# Altium schematic sheet AD7606_Core.SchDoc
size A3
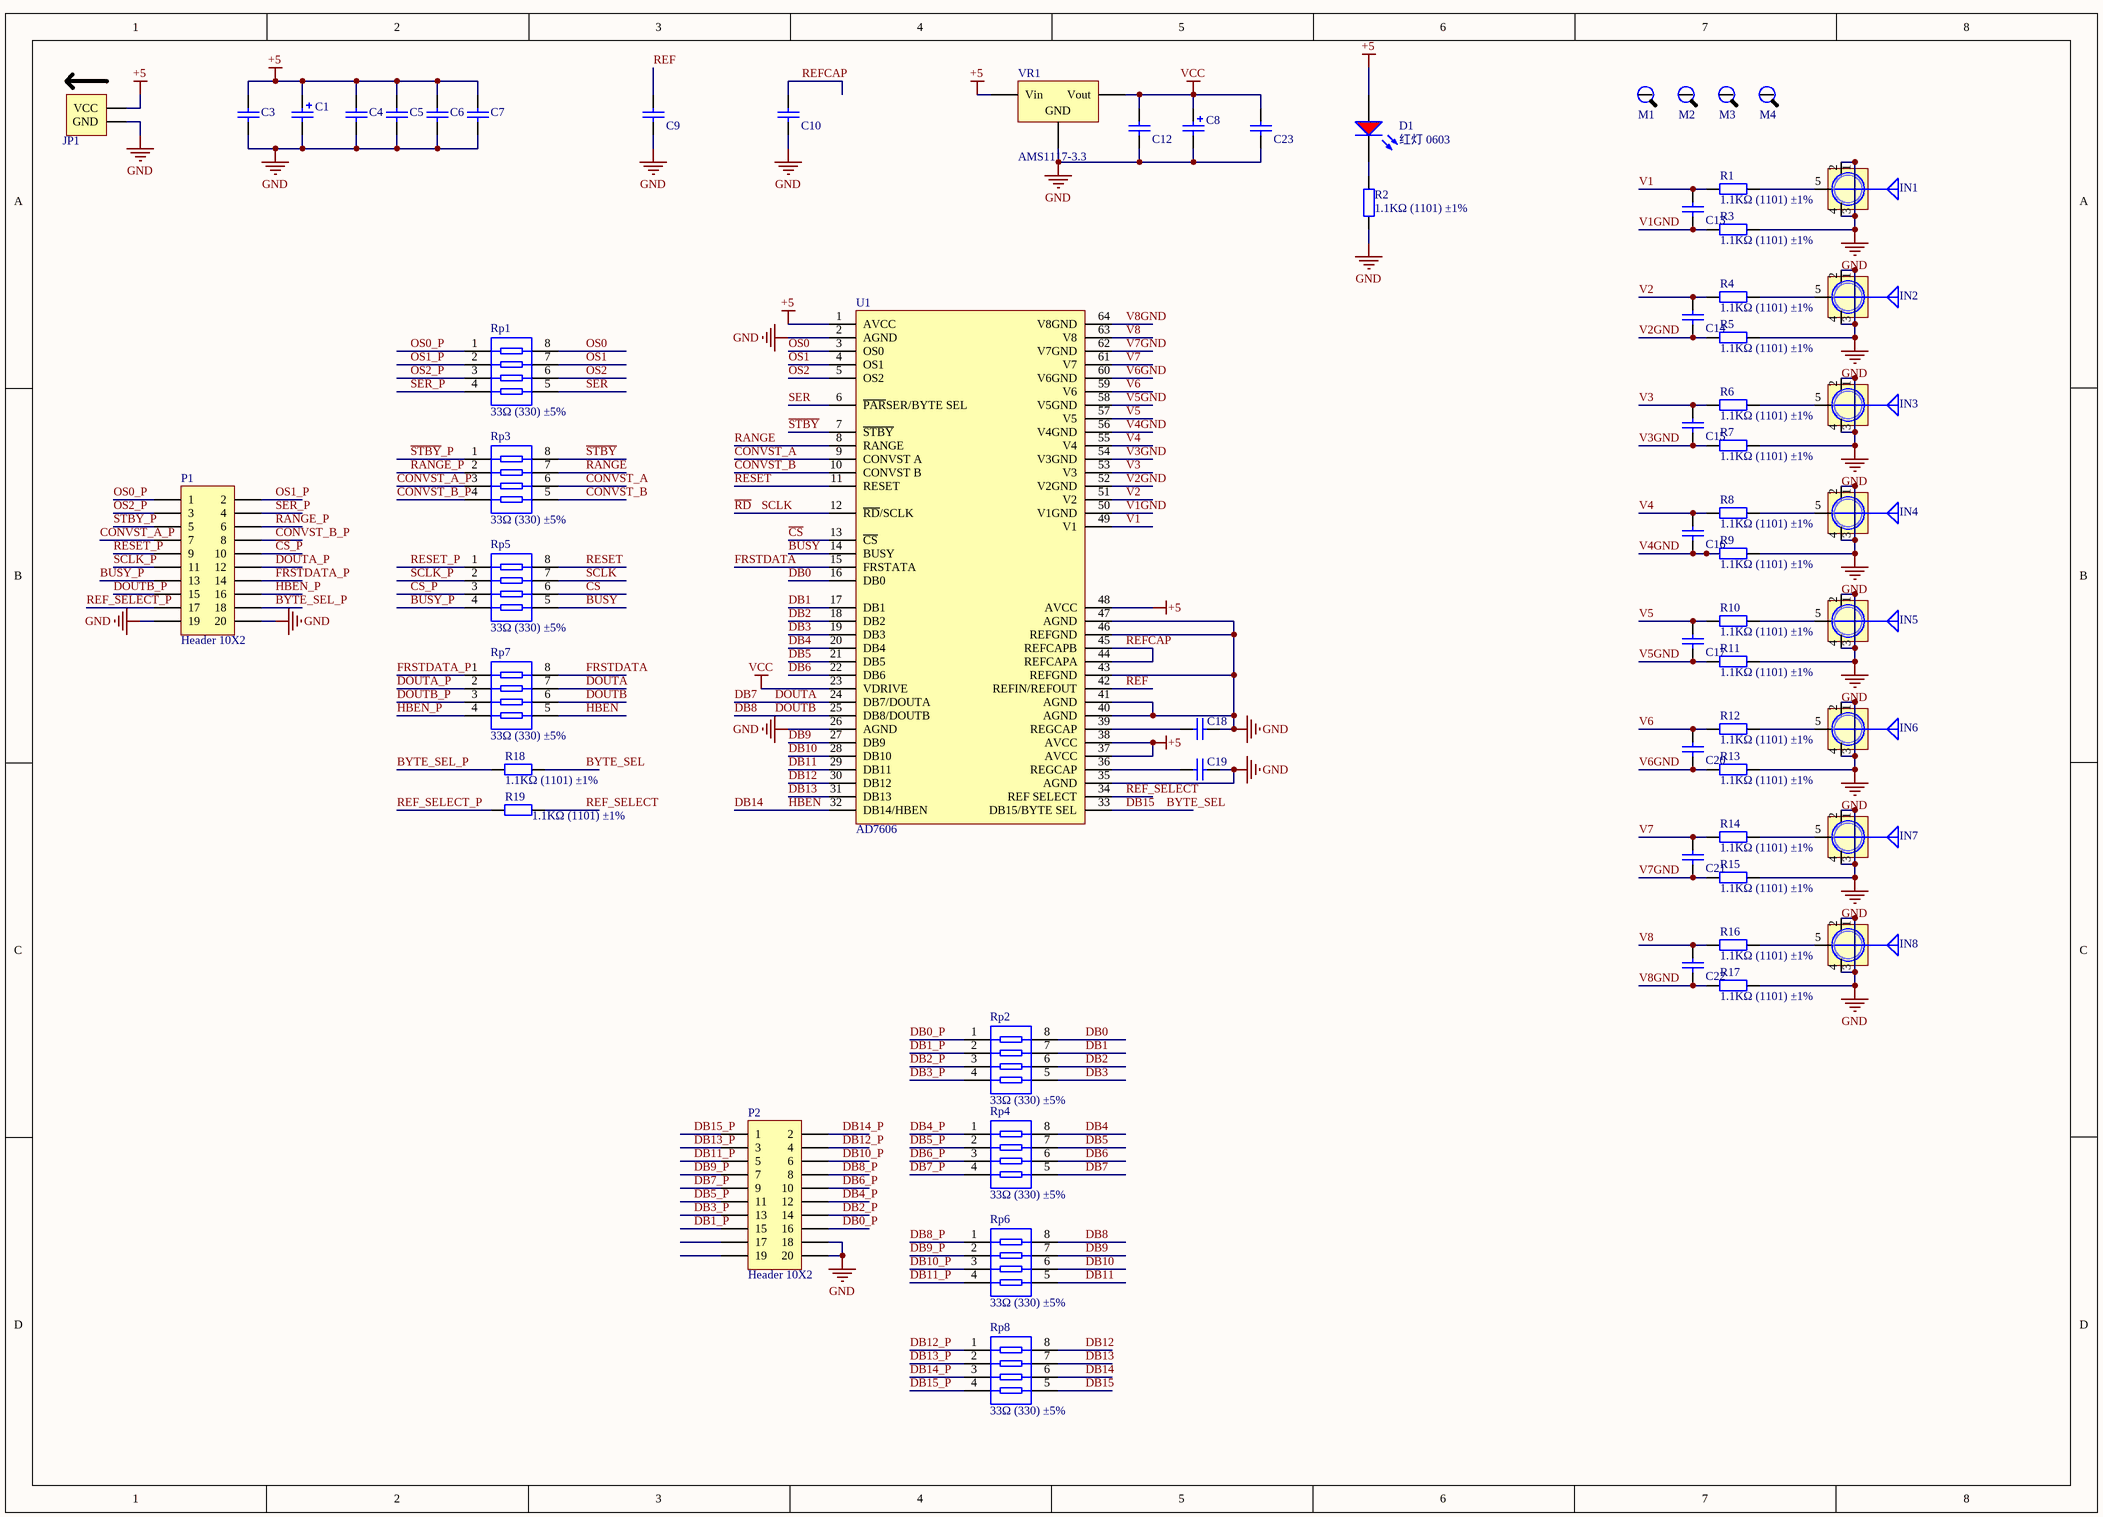
[diagram p0: AD7606_Core.SchDoc]

## Parts
C1  10uF (106) ±10% 16V  [CASE-A_3216]  (value not drawn)
C3  100nF (104) 10% 50V  [0603_C]  (value not drawn)
C4  100nF (104) 10% 50V  [0603_C]  (value not drawn)
C5  100nF (104) 10% 50V  [0603_C]  (value not drawn)
C6  100nF (104) 10% 50V  [0603_C]  (value not drawn)
C7  100nF (104) 10% 50V  [0603_C]  (value not drawn)
C8  10uF (106) ±10% 16V  [CASE-A_3216]  (value not drawn)
C9  100nF (104) 10% 50V  [0603_C]  (value not drawn)
C10  100nF (104) 10% 50V  [0603_C]  (value not drawn)
C12  100nF (104) 10% 50V  [0603_C]  (value not drawn)
C13  100nF (104) 10% 50V  [0603_C]  (value not drawn)
C14  100nF (104) 10% 50V  [0603_C]  (value not drawn)
C15  100nF (104) 10% 50V  [0603_C]  (value not drawn)
C16  100nF (104) 10% 50V  [0603_C]  (value not drawn)
C17  100nF (104) 10% 50V  [0603_C]  (value not drawn)
C18  100nF (104) 10% 50V  [0603_C]  (value not drawn)
C19  100nF (104) 10% 50V  [0603_C]  (value not drawn)
C20  100nF (104) 10% 50V  [0603_C]  (value not drawn)
C21  100nF (104) 10% 50V  [0603_C]  (value not drawn)
C22  100nF (104) 10% 50V  [0603_C]  (value not drawn)
C23  100nF (104) 10% 50V  [0603_C]  (value not drawn)
D1  红灯 0603  [0603_LED_S1]
IN1  SMA WIFI 天线接口  [SMA_L]  (value not drawn)
IN2  SMA WIFI 天线接口  [SMA_L]  (value not drawn)
IN3  SMA WIFI 天线接口  [SMA_L]  (value not drawn)
IN4  SMA WIFI 天线接口  [SMA_L]  (value not drawn)
IN5  SMA WIFI 天线接口  [SMA_L]  (value not drawn)
IN6  SMA WIFI 天线接口  [SMA_L]  (value not drawn)
IN7  SMA WIFI 天线接口  [SMA_L]  (value not drawn)
IN8  SMA WIFI 天线接口  [SMA_L]  (value not drawn)
JP1  HDR-1X2  [Power_IN_3.81-2P]  (value not drawn)
M1  M3  [M3x10_L]  (value not drawn)
M2  M3  [M3x10_L]  (value not drawn)
M3  M3  [M3x10_L]  (value not drawn)
M4  M3  [M3x10_L]  (value not drawn)
P1  Header 10X2  [HDR2X10]
P2  Header 10X2  [HDR2X10]
R1  1.1KΩ (1101) ±1%  [0603_R]
R2  1.1KΩ (1101) ±1%  [0603_R]
R3  1.1KΩ (1101) ±1%  [0603_R]
R4  1.1KΩ (1101) ±1%  [0603_R]
R5  1.1KΩ (1101) ±1%  [0603_R]
R6  1.1KΩ (1101) ±1%  [0603_R]
R7  1.1KΩ (1101) ±1%  [0603_R]
R8  1.1KΩ (1101) ±1%  [0603_R]
R9  1.1KΩ (1101) ±1%  [0603_R]
R10  1.1KΩ (1101) ±1%  [0603_R]
R11  1.1KΩ (1101) ±1%  [0603_R]
R12  1.1KΩ (1101) ±1%  [0603_R]
R13  1.1KΩ (1101) ±1%  [0603_R]
R14  1.1KΩ (1101) ±1%  [0603_R]
R15  1.1KΩ (1101) ±1%  [0603_R]
R16  1.1KΩ (1101) ±1%  [0603_R]
R17  1.1KΩ (1101) ±1%  [0603_R]
R18  1.1KΩ (1101) ±1%  [0603_R]
R19  1.1KΩ (1101) ±1%  [0603_R]
Rp1  33Ω (330) ±5%  [0603_Rx4]
Rp2  33Ω (330) ±5%  [0603_Rx4]
Rp3  33Ω (330) ±5%  [0603_Rx4]
Rp4  33Ω (330) ±5%  [0603_Rx4]
Rp5  33Ω (330) ±5%  [0603_Rx4]
Rp6  33Ω (330) ±5%  [0603_Rx4]
Rp7  33Ω (330) ±5%  [0603_Rx4]
Rp8  33Ω (330) ±5%  [0603_Rx4]
U1  AD7606  [LQFP64 10x10_N]
VR1  AMS1117-3.3  [SOT-223]

## Nets
+5: C1.1 C3.2 C4.2 C5.2 C6.2 C7.2 D1.A JP1.1(VCC) U1.1(AVCC) U1.37(AVCC) U1.38(AVCC) U1.48(AVCC) VR1.3(Vin)
GND: C1.2 C3.1 C4.1 C5.1 C6.1 C7.1 C8.2 C9.2 C10.2 C12.2 C18.1 C19.1 C23.2 IN1.1(GND) IN1.2(GND) IN1.3(GND) IN1.4(GND) IN2.1(GND) IN2.2(GND) IN2.3(GND) IN2.4(GND) IN3.1(GND) IN3.2(GND) IN3.3(GND) IN3.4(GND) IN4.1(GND) IN4.2(GND) IN4.3(GND) IN4.4(GND) IN5.1(GND) IN5.2(GND) IN5.3(GND) IN5.4(GND) IN6.1(GND) IN6.2(GND) IN6.3(GND) IN6.4(GND) IN7.1(GND) IN7.2(GND) IN7.3(GND) IN7.4(GND) IN8.1(GND) IN8.2(GND) IN8.3(GND) IN8.4(GND) JP1.2(GND) P1.19 P1.20 P2.18 P2.20 R2.1 R3.2 R5.2 R7.2 R9.2 R11.2 R13.2 R15.2 R17.2 U1.2(AGND) U1.26(AGND) U1.35(AGND) U1.40(AGND) U1.41(AGND) U1.43(REFGND) U1.46(REFGND) U1.47(AGND) VR1.1(GND)
VCC: C8.1 C12.1 C23.1 U1.23(VDRIVE) VR1.2(Vout)
BUSY: Rp5.5 U1.14(BUSY)
BUSY_P: P1.13 Rp5.4
BYTE_SEL: R18.2 Rp8.5 U1.33(DB15/BYTE_SEL)  [also labelled DB15]
BYTE_SEL_P: P1.18 R18.1
~{CS}: Rp5.6 U1.13(~{CS})
~{CS}_P: P1.10 Rp5.3
CONVST_A: Rp3.6 U1.9(CONVST_A)
CONVST_A_P: P1.7 Rp3.3
CONVST_B: Rp3.5 U1.10(CONVST_B)
CONVST_B_P: P1.8 Rp3.4
DB0: Rp2.8 U1.16(DB0)
DB0_P: P2.16 Rp2.1
DB1: Rp2.7 U1.17(DB1)
DB1_P: P2.15 Rp2.2
DB2: Rp2.6 U1.18(DB2)
DB2_P: P2.14 Rp2.3
DB3: Rp2.5 U1.19(DB3)
DB3_P: P2.13 Rp2.4
DB4: Rp4.8 U1.20(DB4)
DB4_P: P2.12 Rp4.1
DB5: Rp4.7 U1.21(DB5)
DB5_P: P2.11 Rp4.2
DB6: Rp4.6 U1.22(DB6)
DB6_P: P2.10 Rp4.3
DB7: Rp4.5 Rp7.7 U1.24(DB7/DOUTA)  [also labelled DOUTA]
DB7_P: P2.9 Rp4.4
DB8: Rp6.8 Rp7.6 U1.25(DB8/DOUTB)  [also labelled DOUTB]
DB8_P: P2.8 Rp6.1
DB9: Rp6.7 U1.27(DB9)
DB9_P: P2.7 Rp6.2
DB10: Rp6.6 U1.28(DB10)
DB10_P: P2.6 Rp6.3
DB11: Rp6.5 U1.29(DB11)
DB11_P: P2.5 Rp6.4
DB12: Rp8.8 U1.30(DB12)
DB12_P: P2.4 Rp8.1
DB13: Rp8.7 U1.31(DB13)
DB13_P: P2.3 Rp8.2
DB14: Rp7.5 Rp8.6 U1.32(DB14/HBEN)  [also labelled HBEN]
DB14_P: P2.2 Rp8.3
DB15_P: P2.1 Rp8.4
DOUTA_P: P1.12 Rp7.2
DOUTB_P: P1.15 Rp7.3
FRSTDATA: Rp7.8 U1.15(FRSTATA)
FRSTDATA_P: P1.14 Rp7.1
HBEN_P: P1.16 Rp7.4
OS0: Rp1.8 U1.3(OS0)
OS0_P: P1.1 Rp1.1
OS1: Rp1.7 U1.4(OS1)
OS1_P: P1.2 Rp1.2
OS2: Rp1.6 U1.5(OS2)
OS2_P: P1.3 Rp1.3
~{RD}: Rp5.7 U1.12(~{RD}/SCLK)  [also labelled SCLK]
RANGE: Rp3.7 U1.8(RANGE)
RANGE_P: P1.6 Rp3.2
REF: C9.1 U1.42(REFIN/REFOUT)
REF_SELECT: R19.2 U1.34(REF_SELECT)
REF_SELECT_P: P1.17 R19.1
REFCAP: C10.1 U1.44(REFCAPA) U1.45(REFCAPB)
RESET: Rp5.8 U1.11(RESET)
RESET_P: P1.9 Rp5.1
~{STBY}: Rp3.8 U1.7(~{STBY})
~{STBY}_P: P1.5 Rp3.1
SCLK_P: P1.11 Rp5.2
SER: Rp1.5 U1.6(~{PAR}SER/BYTE_SEL)
SER_P: P1.4 Rp1.4
V1: C13.1 R1.1 U1.49(V1)
V1GND: C13.2 R3.1 U1.50(V1GND)
V2: C14.1 R4.1 U1.51(V2)
V2GND: C14.2 R5.1 U1.52(V2GND)
V3: C15.1 R6.1 U1.53(V3)
V3GND: C15.2 R7.1 U1.54(V3GND)
V4: C16.1 R8.1 U1.55(V4)
V4GND: C16.2 R9.1 U1.56(V4GND)
V5: C17.1 R10.1 U1.57(V5)
V5GND: C17.2 R11.1 U1.58(V5GND)
V6: C20.1 R12.1 U1.59(V6)
V6GND: C20.2 R13.1 U1.60(V6GND)
V7: C21.1 R14.1 U1.61(V7)
V7GND: C21.2 R15.1 U1.62(V7GND)
V8: C22.1 R16.1 U1.63(V8)
V8GND: C22.2 R17.1 U1.64(V8GND)
NetC18_2: C18.2 U1.39(REGCAP)
NetC19_2: C19.2 U1.36(REGCAP)
NetD1_K: D1.K R2.2
NetIN1_5: IN1.5(SINGLE) R1.2
NetIN2_5: IN2.5(SINGLE) R4.2
NetIN3_5: IN3.5(SINGLE) R6.2
NetIN4_5: IN4.5(SINGLE) R8.2
NetIN5_5: IN5.5(SINGLE) R10.2
NetIN6_5: IN6.5(SINGLE) R12.2
NetIN7_5: IN7.5(SINGLE) R14.2
NetIN8_5: IN8.5(SINGLE) R16.2

Not connected (* = marked no-connect by the designer): M1 1; M2 1; M3 1; M4 1; P2 17 19

## Library data of the parts
C1 C8 = 3216 10uF (106) 10% 16V: 钽电容; ComponentLink1Description: 供应商链接; ComponentLink1URL: http://www.szlcsc.com/product/details_7643.html; Package: 3216; Supplier: LC; SuppliersPartNumber: C7171
C3-C7 C9 C10 C12-C23 = 0603 100nF (104) 10% 50V: 贴片电容; ComponentLink1Description: 供应商链接; ComponentLink1URL: http://www.szlcsc.com/product/details_15331.html; Package: 0603; Supplier: LC; SuppliersPartNumber: C14663
D1 = 0603 红灯: 发光二极管; ComponentLink1Description: 供应商链接; ComponentLink1URL: http://www.szlcsc.com/product/details_2659.html; Package: 0603; Supplier: LC; SuppliersPartNumber: C2286
IN1-IN8 = PORT_SMA_L: SMA-2.4G射频天线接口; 版权归属: 源创客; BOM名称: SMA-2.4G射频天线接口; 学习资源: www.ooocke.com
JP1 = PORT_Power_IN2: 2P接插件,模块单电源供电口; 版权归属: 源创客; BOM名称: 2P接插件; 学习资源: www.ooocke.com
M1-M4 = ELSE_M3_screw: 螺丝
P1 P2 = Header 10X2: Header, 10-Pin, Dual row; LatestRevisionDate: 17-Jul-2002; LatestRevisionNote: Re-released for DXP Platform.; Publisher: Altium Limited
R1-R19 = 0603 1.1KΩ (1101) 1%: 贴片电阻; ComponentLink1Description: 供应商链接; ComponentLink1URL: http://www.szlcsc.com/product/details_23491.html; Package: 0603; Supplier: LC; SuppliersPartNumber: C22764
Rp1-Rp8 = 0402*4 33Ω (330) 5%: 贴片排阻; ComponentLink1Description: 供应商链接; ComponentLink1URL: http://www.szlcsc.com/product/details_26244.html; Package: 0402*4; Supplier: LC; SuppliersPartNumber: C25501
VR1 = SOT-223 AMS1117-3.3: 低压差线性稳压(LDO); ComponentLink1Description: 供应商链接; ComponentLink1URL: http://www.szlcsc.com/product/details_6652.html; Package: SOT-223; Supplier: LC; SuppliersPartNumber: C6186